# EAGLE schematic milliLearn-ice40-pcbng (EAGLE 9.5.1)

## Sheet 1 of 4
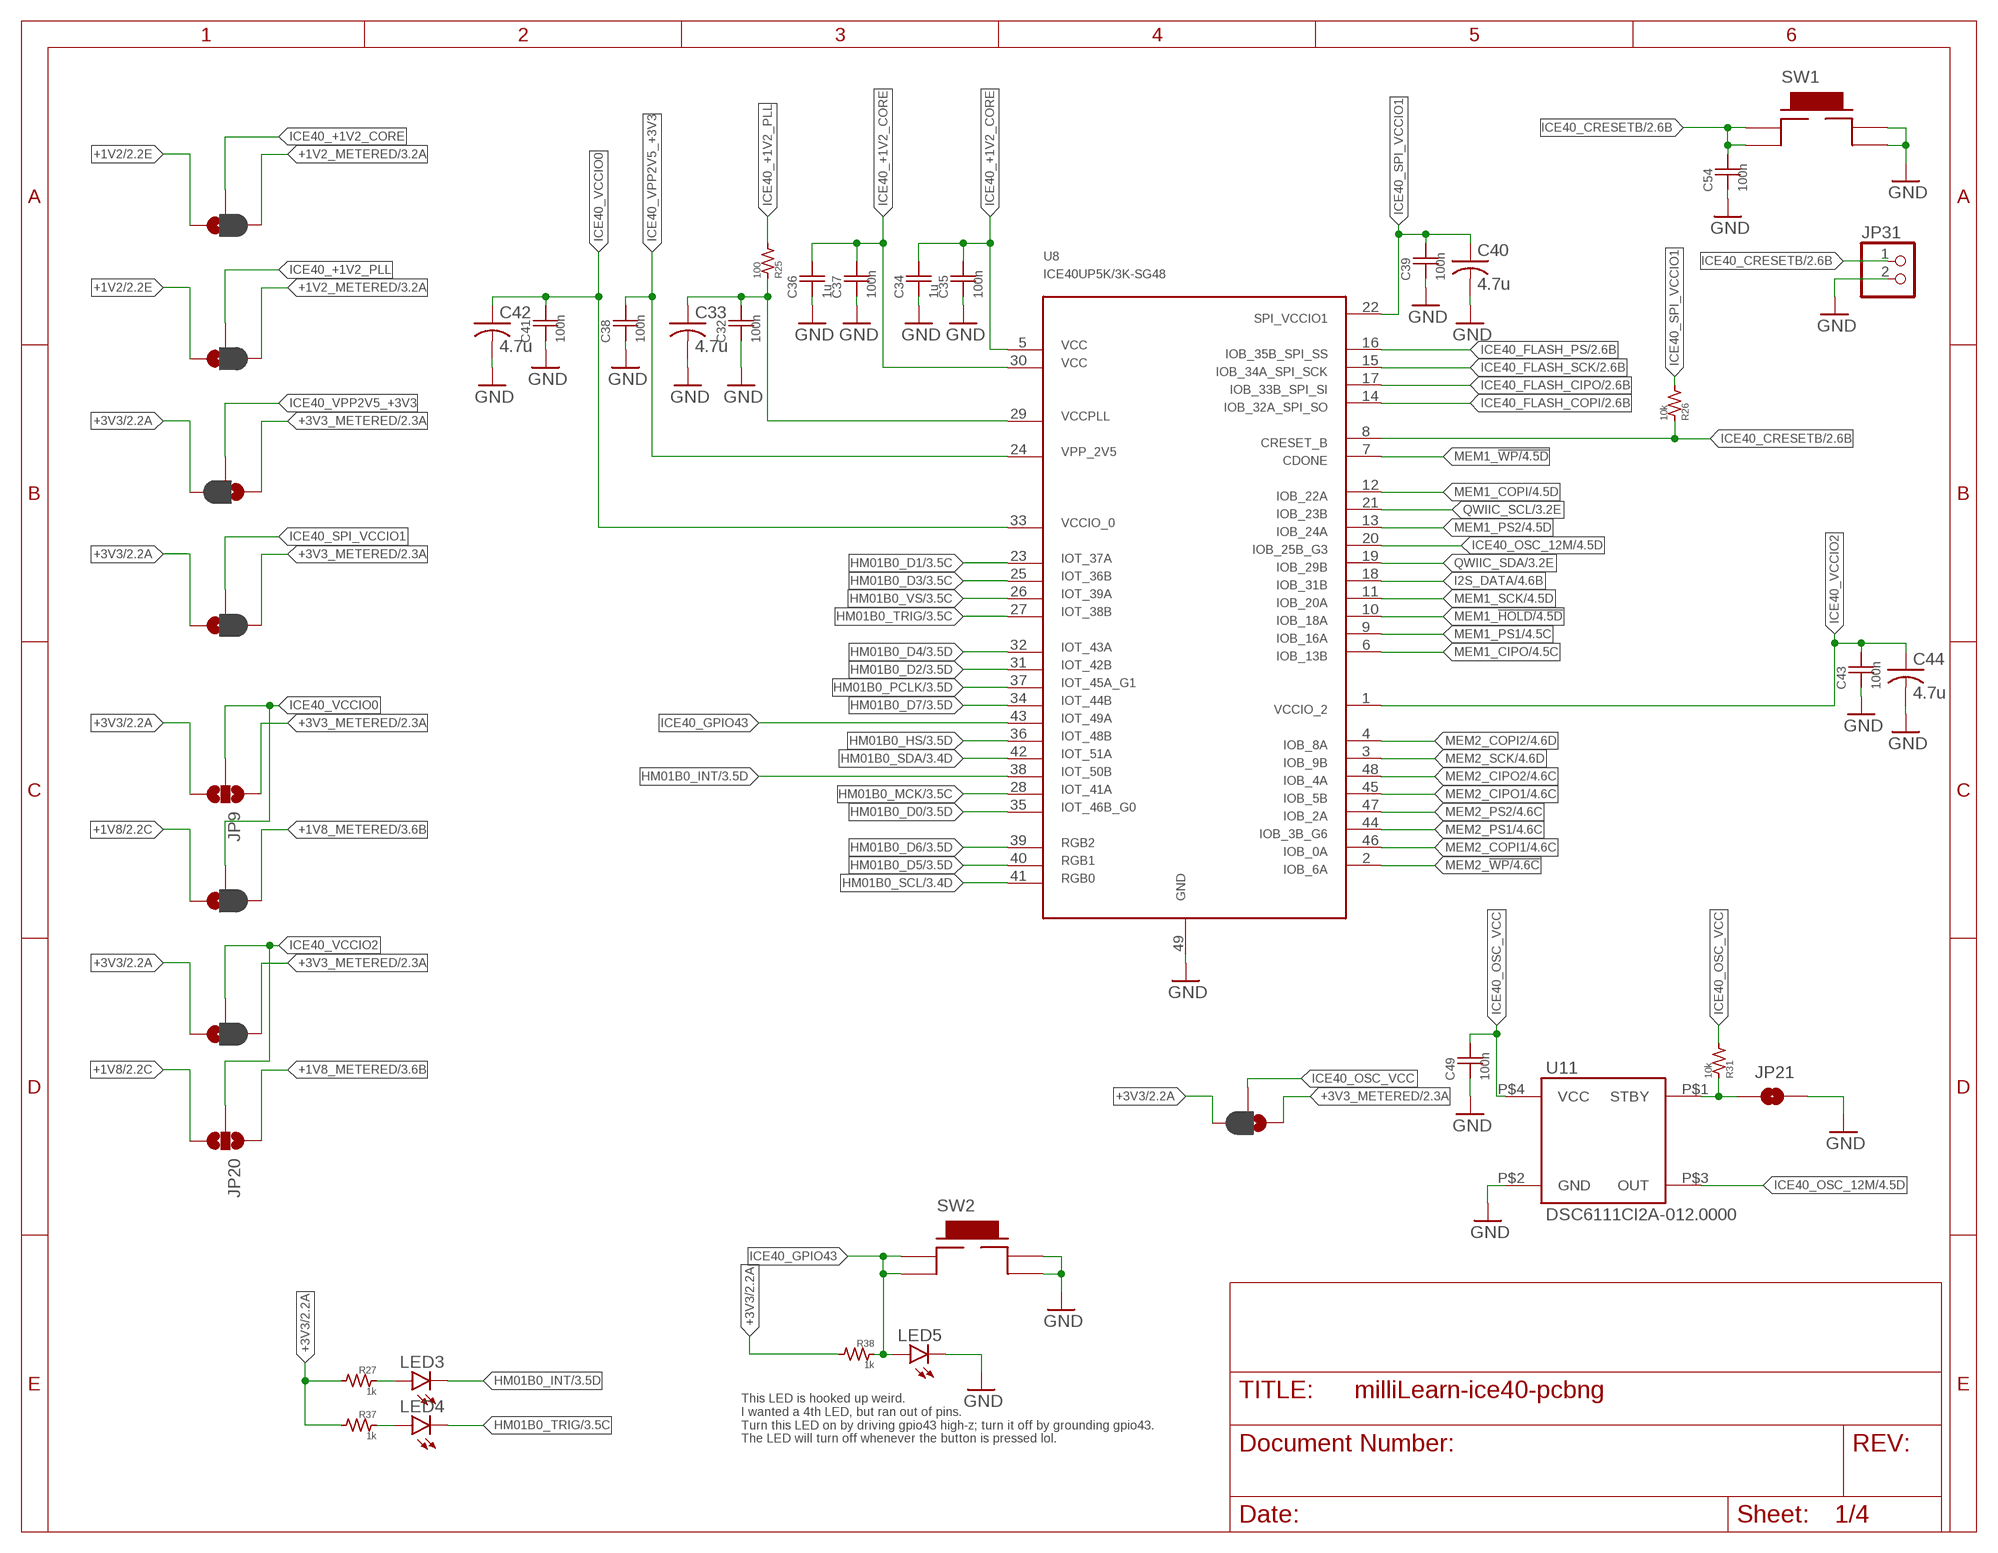
[diagram p0: schematic, sheet 1]

### Parts
C32  100n  C0402_COMPACT  [C0402_COMPACT]
C33  4.7u  C-USC0603  [C0603]
C34  1u  C0402_COMPACT  [C0402_COMPACT]
C35  100n  C0402_COMPACT  [C0402_COMPACT]
C36  1u  C0402_COMPACT  [C0402_COMPACT]
C37  100n  C0402_COMPACT  [C0402_COMPACT]
C38  100n  C0402_COMPACT  [C0402_COMPACT]
C39  100n  C0402_COMPACT  [C0402_COMPACT]
C40  4.7u  C-USC0603  [C0603]
C41  100n  C0402_COMPACT  [C0402_COMPACT]
C42  4.7u  C-USC0603  [C0603]
C43  100n  C0402_COMPACT  [C0402_COMPACT]
C44  4.7u  C-USC0603  [C0603]
C49  100n  C0402_COMPACT  [C0402_COMPACT]
C54  100n  C0402_COMPACT  [C0402_COMPACT]
JP5  JUMPER-SMT_3_1-NC_PASTE_NO-SILK  [SMT-JUMPER_3_1-NC_PASTE_NO-SILK]
JP6  JUMPER-SMT_3_1-NC_PASTE_NO-SILK  [SMT-JUMPER_3_1-NC_PASTE_NO-SILK]
JP7  JUMPER-SMT_3_1-NC_PASTE_NO-SILK  [SMT-JUMPER_3_1-NC_PASTE_NO-SILK]
JP8  JUMPER-SMT_3_1-NC_PASTE_NO-SILK  [SMT-JUMPER_3_1-NC_PASTE_NO-SILK]
JP9  JUMPER-SMT_3_NO_NO-SILK  [SMT-JUMPER_3_NO_NO-SILK]
JP13  JUMPER-SMT_3_1-NC_PASTE_NO-SILK  [SMT-JUMPER_3_1-NC_PASTE_NO-SILK]
JP14  JUMPER-SMT_3_1-NC_PASTE_NO-SILK  [SMT-JUMPER_3_1-NC_PASTE_NO-SILK]
JP19  JUMPER-SMT_3_1-NC_PASTE_NO-SILK  [SMT-JUMPER_3_1-NC_PASTE_NO-SILK]
JP20  JUMPER-SMT_3_NO_NO-SILK  [SMT-JUMPER_3_NO_NO-SILK]
JP21  JUMPER-SMT_2_NO_NO-SILK  [SMT-JUMPER_2_NO_NO-SILK]
JP31  PINHD-1X2  [1X02]
LED3  LEDCHIPLED_0603  [CHIPLED_0603]
LED4  LEDCHIPLED_0603  [CHIPLED_0603]
LED5  LEDCHIPLED_0603  [CHIPLED_0603]
R25  100  R0402_COMPACT  [R0402_COMPACT]
R26  10k  R0402_COMPACT  [R0402_COMPACT]
R27  1k  R0402_COMPACT  [R0402_COMPACT]
R31  10k  R0402_COMPACT  [R0402_COMPACT]
R37  1k  R0402_COMPACT  [R0402_COMPACT]
R38  1k  R0402_COMPACT  [R0402_COMPACT]
SW1  TE_FSMJSMA  [TE_FSMJSMA]
SW2  TE_FSMJSMA  [TE_FSMJSMA]
U8  ICE40UP5K/3K-SG48  [ICE40UP5K/3K-SG48]
U11  DSC6111CI2A-012.0000  [DSC6111CI2A-012.0000]

### Nets
+1V2: JP5.1 JP6.1 ; also sheet 2,3
+1V2_METERED: JP5.3 JP6.3 ; also sheet 3
+1V8: JP13.1 JP20.3 ; also sheet 2,3,4
+1V8_METERED: JP13.3 JP20.1 ; also sheet 3,4
+3V3: JP7.3 JP8.1 JP9.3 JP14.1 JP19.3 R27.1 R37.1 R38.1 ; also sheet 2,3,4
+3V3_METERED: JP7.1 JP8.3 JP9.1 JP14.3 JP19.1 ; also sheet 2,3,4
GND: C32.1 C33.2 C34.1 C35.1 C36.1 C37.1 C38.1 C39.1 C40.2 C41.1 C42.2 C43.1 C44.2 C49.1 C54.1 JP21.2 JP31.2 LED5.C SW1.P$3 SW1.P$4 SW2.P$3 SW2.P$4 U8.49 U11.P$2(GND) ; also sheet 2,3,4
HM01B0_D0: U8.35 ; also sheet 3
HM01B0_D1: U8.23 ; also sheet 3
HM01B0_D2: U8.31 ; also sheet 3
HM01B0_D3: U8.25 ; also sheet 3
HM01B0_D4: U8.32 ; also sheet 3
HM01B0_D5: U8.40 ; also sheet 3
HM01B0_D6: U8.39 ; also sheet 3
HM01B0_D7: U8.34 ; also sheet 3
HM01B0_HS: U8.36 ; also sheet 3
HM01B0_INT: LED3.C U8.38 ; also sheet 3
HM01B0_MCK: U8.28 ; also sheet 3
HM01B0_PCLK: U8.37 ; also sheet 3
HM01B0_SCL: U8.41 ; also sheet 3
HM01B0_SDA: U8.42 ; also sheet 3
HM01B0_TRIG: LED4.C U8.27 ; also sheet 3
HM01B0_VS: U8.26 ; also sheet 3
I2S_DATA: U8.18 ; also sheet 4
ICE40_+1V2_CORE: C34.2 C35.2 C36.2 C37.2 JP5.2 U8.5 U8.30
ICE40_+1V2_PLL: JP6.2 R25.1
ICE40_CRESETB: C54.2 JP31.1 R26.2 SW1.P$1 SW1.P$2 U8.8 ; also sheet 2
ICE40_FLASH_CIPO: U8.17 ; also sheet 2,4
ICE40_FLASH_COPI: U8.14 ; also sheet 2,4
ICE40_FLASH_PS: U8.16 ; also sheet 2,4
ICE40_FLASH_SCK: U8.15 ; also sheet 2,4
ICE40_GPIO43: LED5.A R38.2 SW2.P$1 SW2.P$2 U8.43
ICE40_OSC_12M: U8.20 U11.P$3(OUT) ; also sheet 4
ICE40_OSC_VCC: C49.2 JP19.2 R31.1 U11.P$4(VCC)
ICE40_SPI_VCCIO1: C39.2 C40.1 JP8.2 R26.1 U8.22
ICE40_VCCIO0: C41.2 C42.1 JP9.2 JP13.2 U8.33
ICE40_VCCIO2: C43.2 C44.1 JP14.2 JP20.2 U8.1
ICE40_VCCPLL: C32.2 C33.1 R25.2 U8.29
ICE40_VPP2V5_+3V3: C38.2 JP7.2 U8.24
MEM1_!HOLD: U8.10 ; also sheet 4
MEM1_!WP: U8.7 ; also sheet 4
MEM1_CIPO: U8.6 ; also sheet 4
MEM1_COPI: U8.12 ; also sheet 4
MEM1_PS1: U8.9 ; also sheet 4
MEM1_PS2: U8.13 ; also sheet 4
MEM1_SCK: U8.11 ; also sheet 4
MEM2_!WP: U8.2 ; also sheet 4
MEM2_CIPO1: U8.45 ; also sheet 4
MEM2_CIPO2: U8.48 ; also sheet 4
MEM2_COPI1: U8.46 ; also sheet 4
MEM2_COPI2: U8.4 ; also sheet 4
MEM2_PS1: U8.44 ; also sheet 4
MEM2_PS2: U8.47 ; also sheet 4
MEM2_SCK: U8.3 ; also sheet 4
N$30: JP21.1 R31.2 U11.P$1(STBY)
N$31: LED3.A R27.2
N$33: LED4.A R37.2
QWIIC_SCL: U8.21 ; also sheet 3,4
QWIIC_SDA: U8.19 ; also sheet 3,4

### Notes on the sheet
- This LED is hooked up weird.
  I wanted a 4th LED, but ran out of pins.
  Turn this LED on by driving gpio43 high-z; turn it off by grounding gpio43.
  The LED will turn off whenever the button is pressed lol.

## Sheet 2 of 4
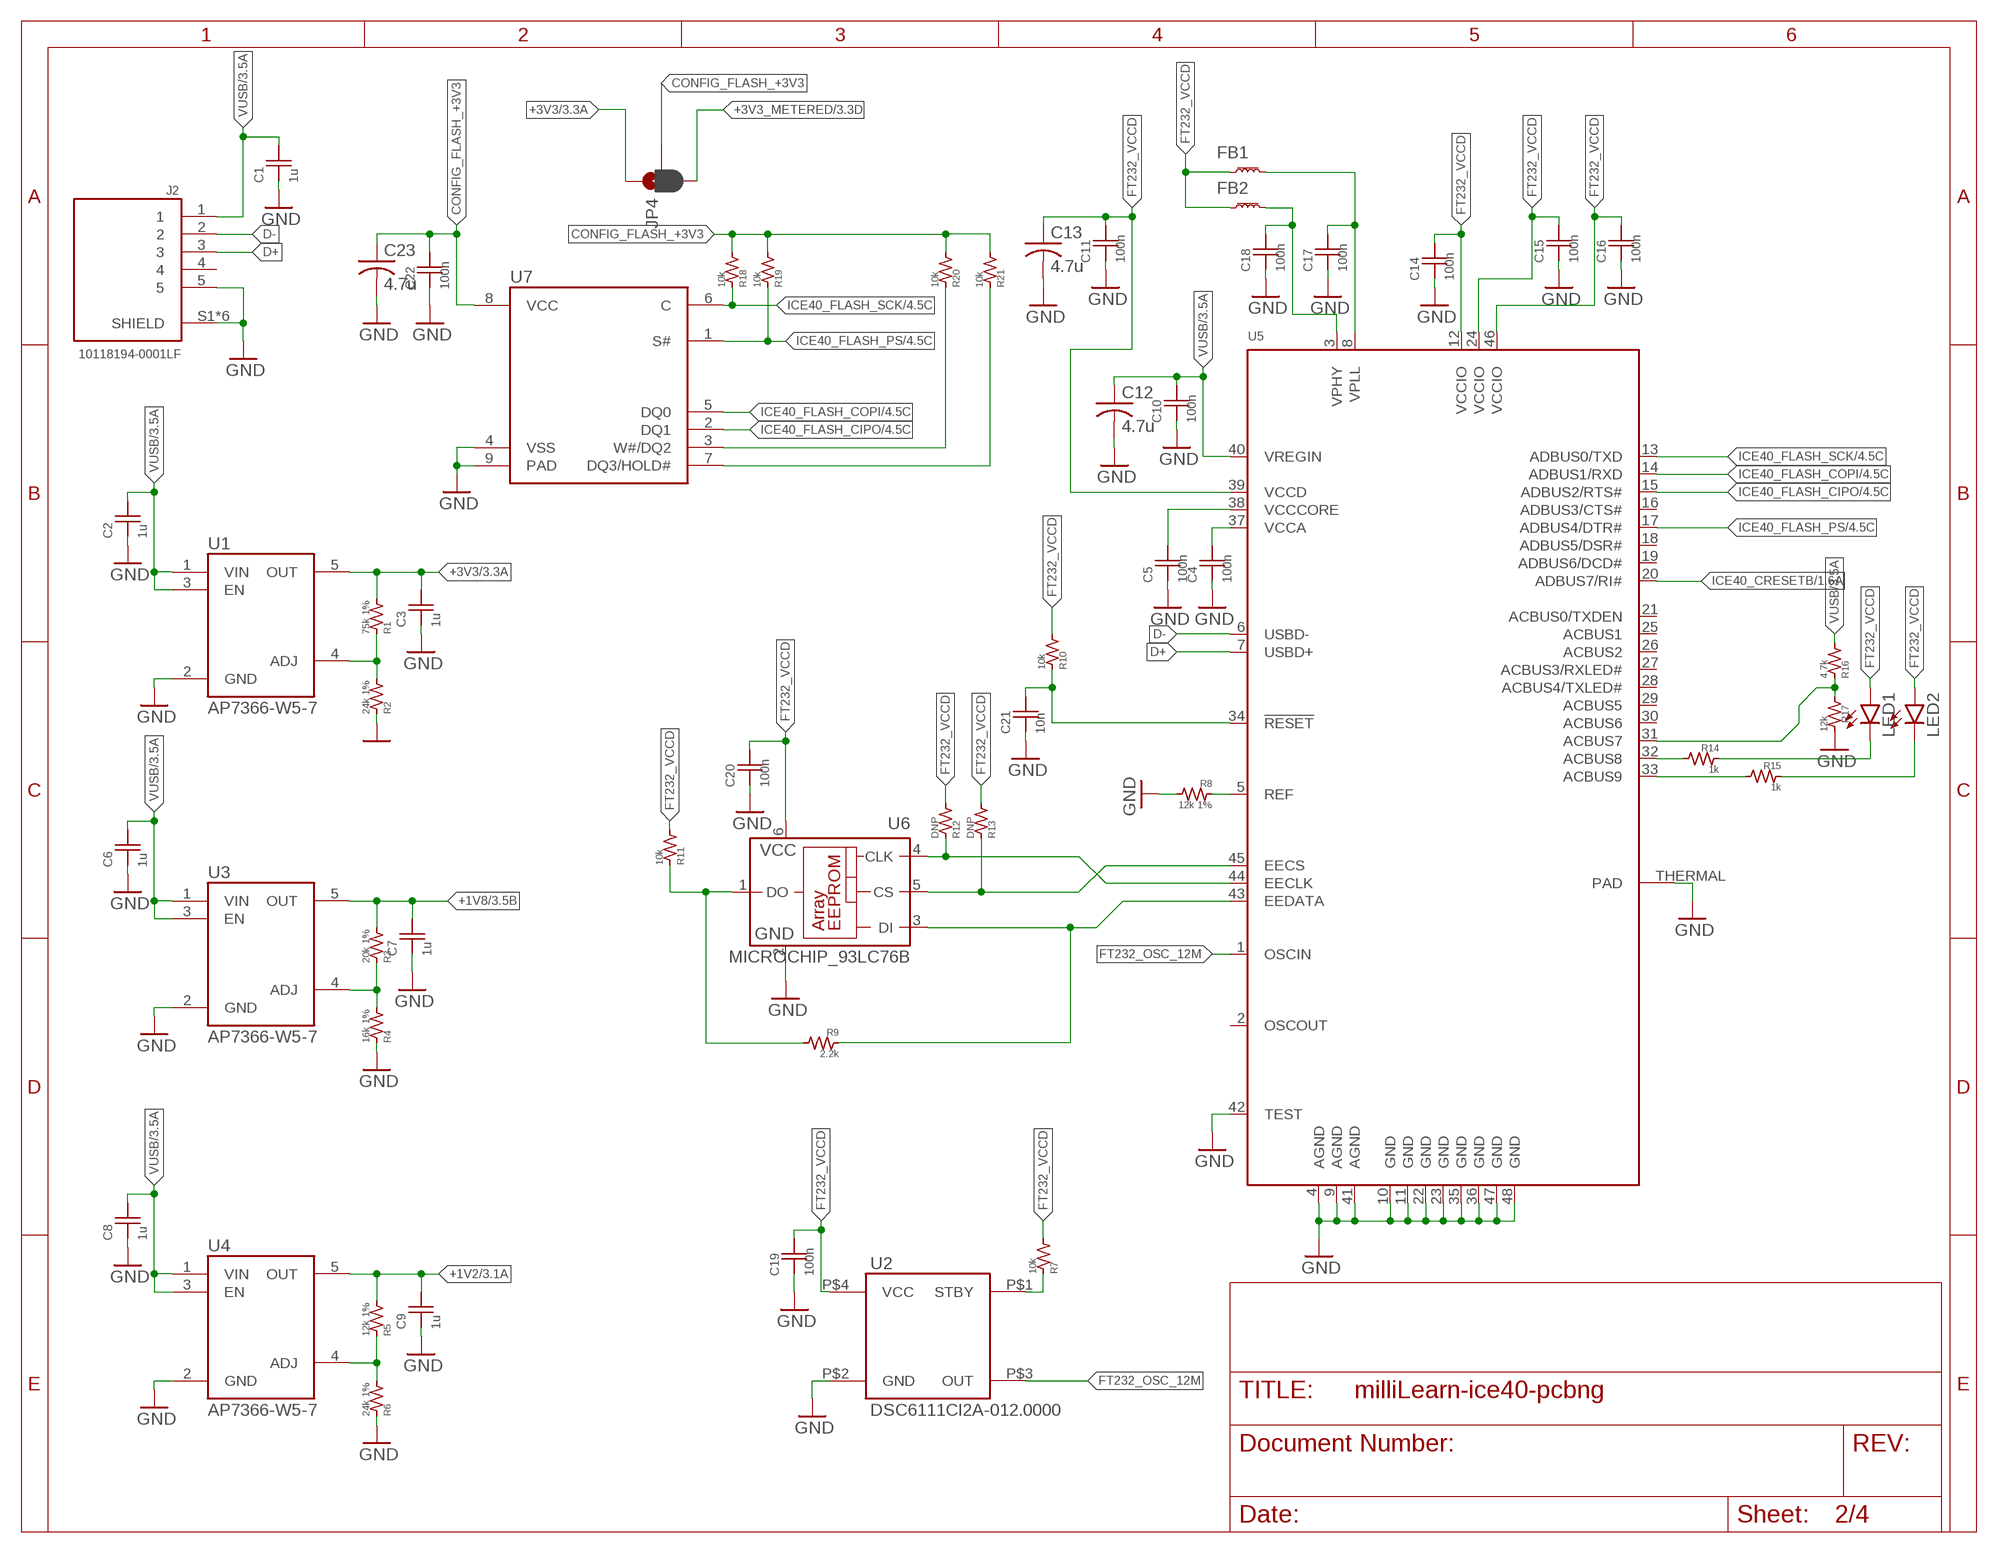
[diagram p1: schematic, sheet 2]

### Parts
C1  1u  C0402_COMPACT  [C0402_COMPACT]
C2  1u  C0402_COMPACT  [C0402_COMPACT]
C3  1u  C0402_COMPACT  [C0402_COMPACT]
C4  100n  C0402_COMPACT  [C0402_COMPACT]
C5  100n  C0402_COMPACT  [C0402_COMPACT]
C6  1u  C0402_COMPACT  [C0402_COMPACT]
C7  1u  C0402_COMPACT  [C0402_COMPACT]
C8  1u  C0402_COMPACT  [C0402_COMPACT]
C9  1u  C0402_COMPACT  [C0402_COMPACT]
C10  100n  C0402_COMPACT  [C0402_COMPACT]
C11  100n  C0402_COMPACT  [C0402_COMPACT]
C12  4.7u  C-USC0603  [C0603]
C13  4.7u  C-USC0603  [C0603]
C14  100n  C0402_COMPACT  [C0402_COMPACT]
C15  100n  C0402_COMPACT  [C0402_COMPACT]
C16  100n  C0402_COMPACT  [C0402_COMPACT]
C17  100n  C0402_COMPACT  [C0402_COMPACT]
C18  100n  C0402_COMPACT  [C0402_COMPACT]
C19  100n  C0402_COMPACT  [C0402_COMPACT]
C20  100n  C0402_COMPACT  [C0402_COMPACT]
C21  10n  C0402_COMPACT  [C0402_COMPACT]
C22  100n  C0402_COMPACT  [C0402_COMPACT]
C23  4.7u  C-USC0603  [C0603]
FB1  BLM18KG601SN1D  [BLM18KG601SN1D]
FB2  BLM18KG601SN1D  [BLM18KG601SN1D]
J2  10118194-0001LF  [AMPHENOL_10118194-0001LF]
JP4  JUMPER-SMT_3_1-NC_PASTE_NO-SILK  [SMT-JUMPER_3_1-NC_PASTE_NO-SILK]
LED1  LEDCHIPLED_0603  [CHIPLED_0603]
LED2  LEDCHIPLED_0603  [CHIPLED_0603]
R1  75k 1%  R0402_COMPACT  [R0402_COMPACT]
R2  24k 1%  R0402_COMPACT  [R0402_COMPACT]
R3  20k 1%  R0402_COMPACT  [R0402_COMPACT]
R4  16k 1%  R0402_COMPACT  [R0402_COMPACT]
R5  12k 1%  R0402_COMPACT  [R0402_COMPACT]
R6  24k 1%  R0402_COMPACT  [R0402_COMPACT]
R7  10k  R0402_COMPACT  [R0402_COMPACT]
R8  12k 1%  R0402_COMPACT  [R0402_COMPACT]
R9  2.2k  R0402_COMPACT  [R0402_COMPACT]
R10  10k  R0402_COMPACT  [R0402_COMPACT]
R11  10k  R0402_COMPACT  [R0402_COMPACT]
R12  DNP  R0402_COMPACT  [R0402_COMPACT]
R13  DNP  R0402_COMPACT  [R0402_COMPACT]
R14  1k  R0402_COMPACT  [R0402_COMPACT]
R15  1k  R0402_COMPACT  [R0402_COMPACT]
R16  4.7k  R0402_COMPACT  [R0402_COMPACT]
R17  12k  R0402_COMPACT  [R0402_COMPACT]
R18  10k  R0402_COMPACT  [R0402_COMPACT]
R19  10k  R0402_COMPACT  [R0402_COMPACT]
R20  10k  R0402_COMPACT  [R0402_COMPACT]
R21  10k  R0402_COMPACT  [R0402_COMPACT]
U1  AP7366-W5-7  [AP7366-W5-7]
U2  DSC6111CI2A-012.0000  [DSC6111CI2A-012.0000]
U3  AP7366-W5-7  [AP7366-W5-7]
U4  AP7366-W5-7  [AP7366-W5-7]
U5  MICROBUILDER_FT232HQ  [MICROBUILDER_QFN48_8MM]
U6  MICROCHIP_93LC76B  [MICROCHIP_SOT23-6]
U7  MT25QL128ABA1EW7  [MT25QL128ABA1EW7]

### Nets
+1V2: C9.2 R5.1 U4.5(OUT) ; also sheet 1,3
+1V8: C7.2 R3.1 U3.5(OUT) ; also sheet 1,3,4
+3V3: C3.2 JP4.1 R1.1 U1.5(OUT) ; also sheet 1,3,4
+3V3_METERED: JP4.3 ; also sheet 1,3,4
CONFIG_FLASH_+3V3: C22.2 C23.1 JP4.2 R18.1 R19.1 R20.1 R21.1 U7.8(VCC)
D+: J2.3 U5.7(USBD+)
D-: J2.2 U5.6(USBD-)
FT232_OSC_12M: U2.P$3(OUT) U5.1(OSCIN)
FT232_VCCD: C11.2 C13.1 C14.2 C15.2 C16.2 C19.2 C20.2 FB1.1 FB2.1 LED1.A LED2.A R7.1 R10.1 R11.1 R12.1 R13.1 U2.P$4(VCC) U5.12(VCCIO) U5.24(VCCIO) U5.39(VCCD) U5.46(VCCIO) U6.6(VCC)
GND: C1.1 C2.1 C3.1 C4.1 C5.1 C6.1 C7.1 C8.1 C9.1 C10.1 C11.1 C12.2 C13.2 C14.1 C15.1 C16.1 C17.1 C18.1 C19.1 C20.1 C21.1 C22.1 C23.2 J2.5 J2.S1(SHIELD) J2.S2(SHIELD) J2.S3(SHIELD) J2.S4(SHIELD) J2.S5(SHIELD) J2.S6(SHIELD) R2.2 R4.2 R6.2 R8.1 R17.2 U1.2(GND) U2.P$2(GND) U3.2(GND) U4.2(GND) U5.4(AGND) U5.9(AGND) U5.10(GND) U5.11(GND) U5.22(GND) U5.23(GND) U5.35(GND) U5.36(GND) U5.41(AGND) U5.42(TEST) U5.47(GND) U5.48(GND) U5.THERMAL(PAD) U6.2(GND) U7.4(VSS) U7.9(PAD) ; also sheet 1,3,4
ICE40_CRESETB: U5.20(ADBUS7/RI#) ; also sheet 1
ICE40_FLASH_CIPO: U5.15(ADBUS2/RTS#) U7.2(DQ1) ; also sheet 1,4
ICE40_FLASH_COPI: U5.14(ADBUS1/RXD) U7.5(DQ0) ; also sheet 1,4
ICE40_FLASH_PS: R19.2 U5.17(ADBUS4/DTR#) U7.1(S#) ; also sheet 1,4
ICE40_FLASH_SCK: R18.2 U5.13(ADBUS0/TXD) U7.6(C) ; also sheet 1,4
N$1: R5.2 R6.1 U4.4(ADJ)
N$2: R1.2 R2.1 U1.4(ADJ)
N$4: C18.2 FB2.2 U5.3(VPHY)
N$5: C17.2 FB1.2 U5.8(VPLL)
N$6: R3.2 R4.1 U3.4(ADJ)
N$7: R7.2 U2.P$1(STBY)
N$8: R9.1 R11.2 U6.1(DO)
N$9: R8.2 U5.5(REF)
N$10: R9.2 U5.43(EEDATA) U6.3(DI)
N$11: R13.2 U5.45(EECS) U6.5(CS)
N$12: R12.2 U5.44(EECLK) U6.4(CLK)
N$13: R14.1 U5.32(ACBUS8)
N$14: C21.2 R10.2 U5.34(!RESET)
N$15: LED1.C R14.2
N$16: R16.2 R17.1 U5.31(ACBUS7)
N$17: R15.1 U5.33(ACBUS9)
N$18: LED2.C R15.2
N$19: R20.2 U7.3(W#/DQ2)
N$20: R21.2 U7.7(DQ3/HOLD#)
VCCA: C4.2 U5.37(VCCA)
VCCCORE: C5.2 U5.38(VCCCORE)
VUSB: C1.2 C2.2 C6.2 C8.2 C10.2 C12.1 J2.1 R16.1 U1.1(VIN) U1.3(EN) U3.1(VIN) U3.3(EN) U4.1(VIN) U4.3(EN) U5.40(VREGIN) ; also sheet 3
Unconnected: J2.4 U5.2(OSCOUT) U5.16(ADBUS3/CTS#) U5.18(ADBUS5/DSR#) U5.19(ADBUS6/DCD#) U5.21(ACBUS0/TXDEN) U5.25(ACBUS1) U5.26(ACBUS2) U5.27(ACBUS3/RXLED#) U5.28(ACBUS4/TXLED#) U5.29(ACBUS5) U5.30(ACBUS6)

## Sheet 3 of 4
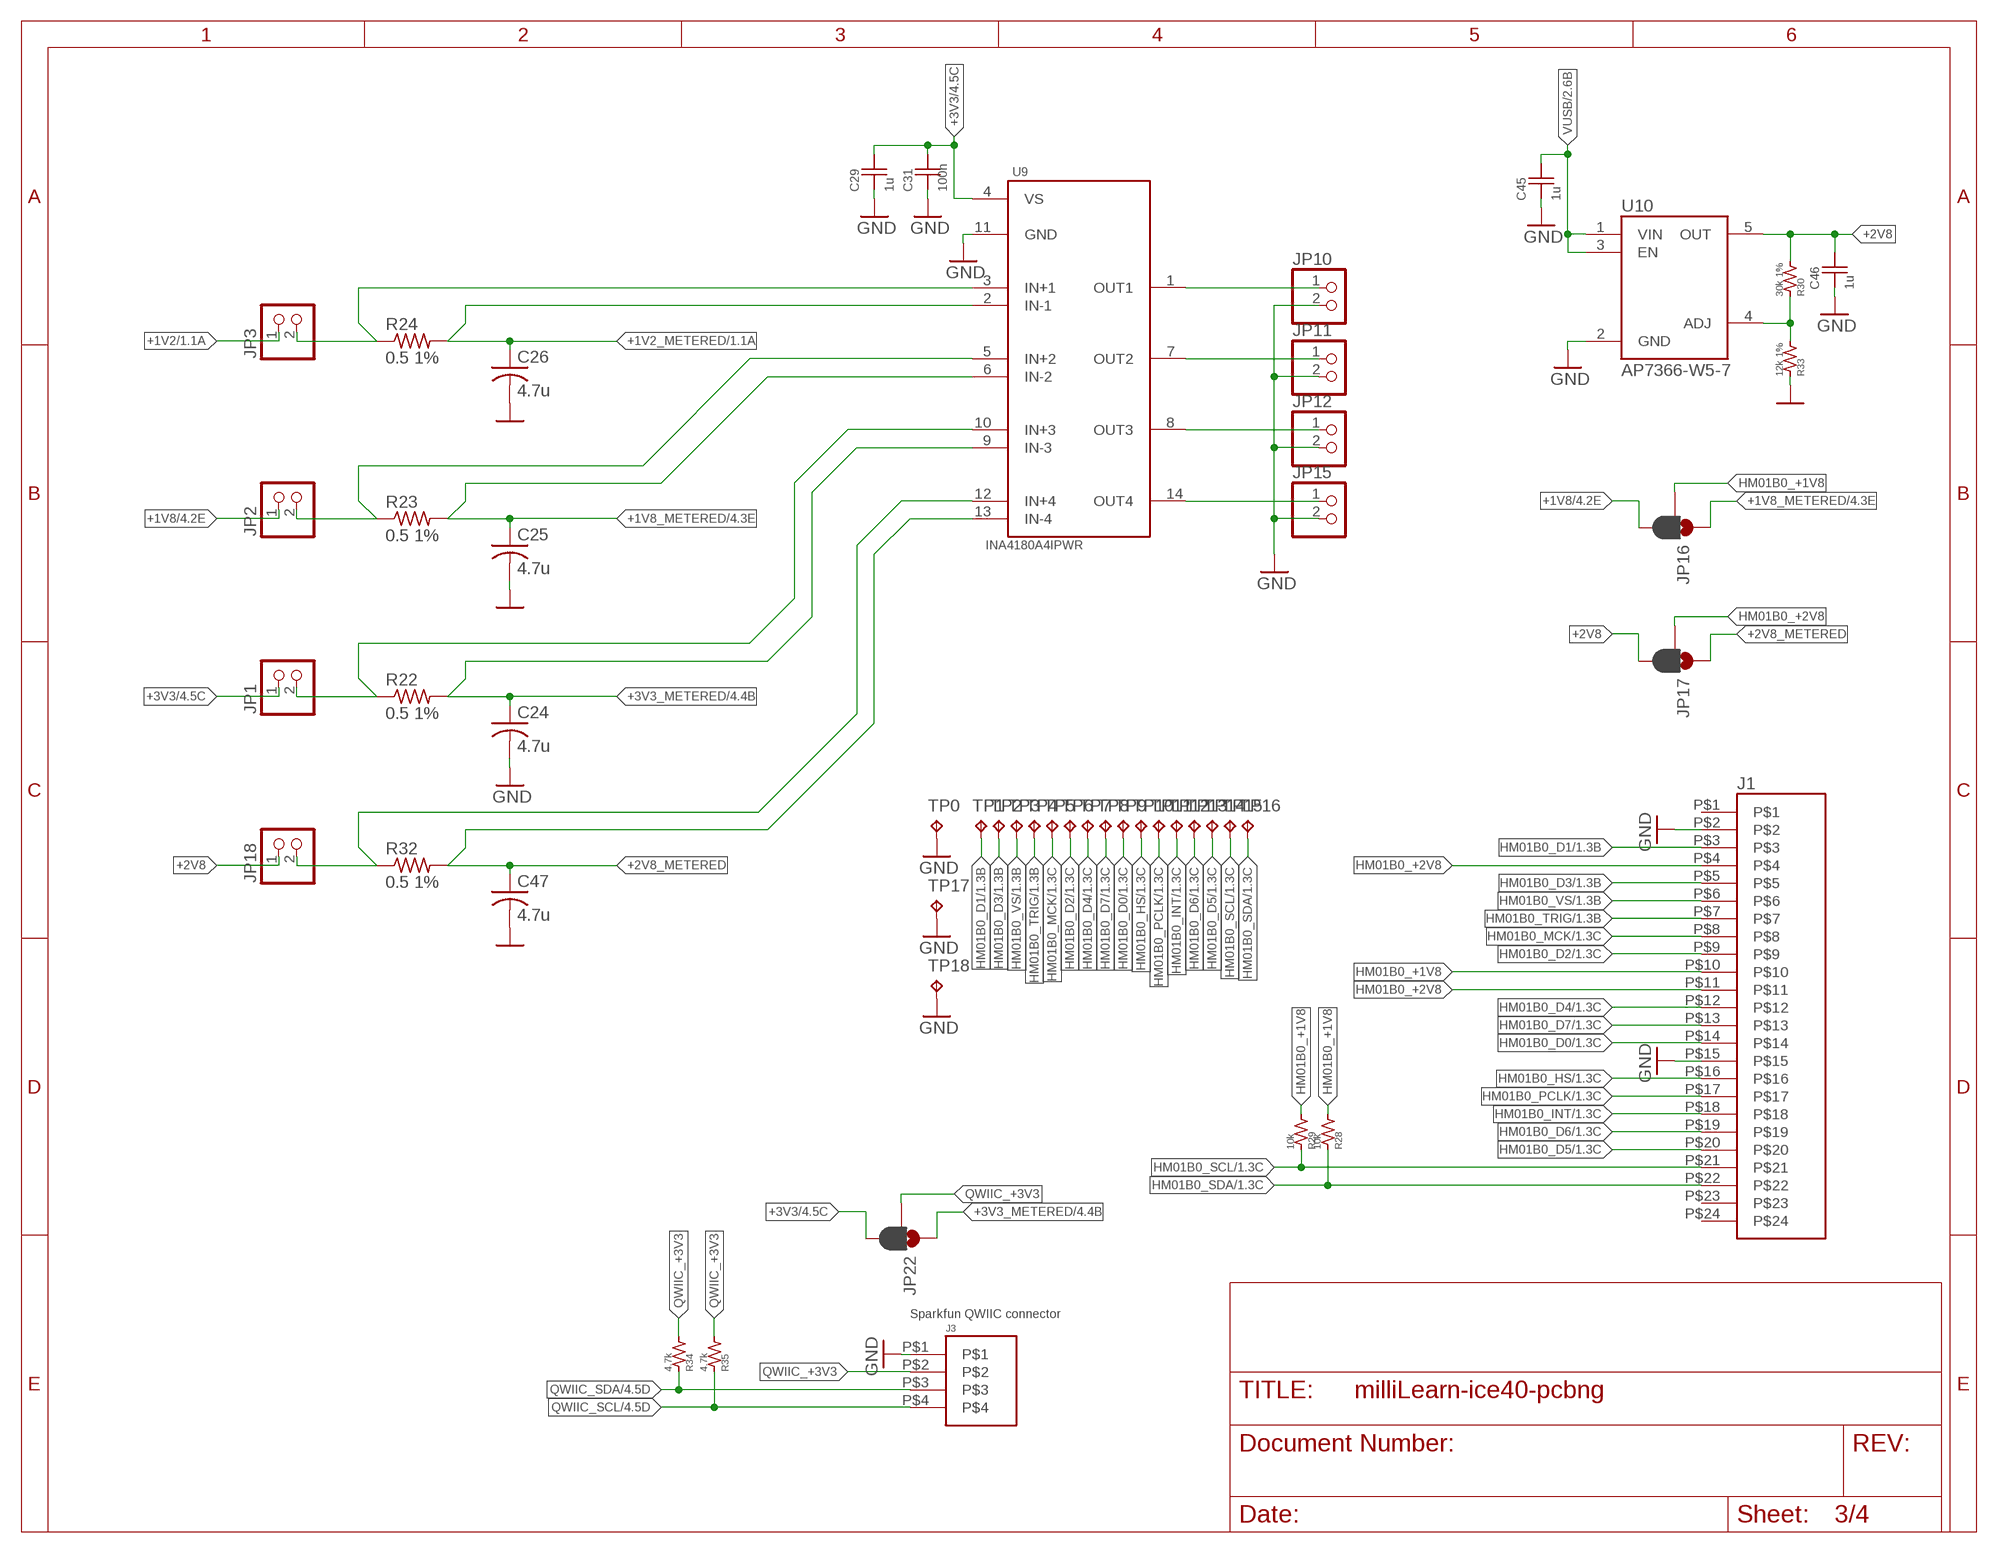
[diagram p2: schematic, sheet 3]

### Parts
C24  4.7u  C-USC0603  [C0603]
C25  4.7u  C-USC0603  [C0603]
C26  4.7u  C-USC0603  [C0603]
C29  1u  C0402_COMPACT  [C0402_COMPACT]
C31  100n  C0402_COMPACT  [C0402_COMPACT]
C45  1u  C0402_COMPACT  [C0402_COMPACT]
C46  1u  C0402_COMPACT  [C0402_COMPACT]
C47  4.7u  C-USC0603  [C0603]
J1  SFV24R-2STE1HLF  [SFV24R-2STE1HLF]
J3  SM04B-SRSS-TB(LF)(SN)  [SM04B-SRSS-TB(LF)(SN)]
JP1  PINHD-1X2  [1X02]
JP2  PINHD-1X2  [1X02]
JP3  PINHD-1X2  [1X02]
JP10  PINHD-1X2  [1X02]
JP11  PINHD-1X2  [1X02]
JP12  PINHD-1X2  [1X02]
JP15  PINHD-1X2  [1X02]
JP16  JUMPER-SMT_3_1-NC_PASTE_NO-SILK  [SMT-JUMPER_3_1-NC_PASTE_NO-SILK]
JP17  JUMPER-SMT_3_1-NC_PASTE_NO-SILK  [SMT-JUMPER_3_1-NC_PASTE_NO-SILK]
JP18  PINHD-1X2  [1X02]
JP22  JUMPER-SMT_3_1-NC_PASTE_NO-SILK  [SMT-JUMPER_3_1-NC_PASTE_NO-SILK]
R22  0.5 1%  R-US_R0603  [R0603]
R23  0.5 1%  R-US_R0603  [R0603]
R24  0.5 1%  R-US_R0603  [R0603]
R28  10k  R0402_COMPACT  [R0402_COMPACT]
R29  10k  R0402_COMPACT  [R0402_COMPACT]
R30  30k 1%  R0402_COMPACT  [R0402_COMPACT]
R32  0.5 1%  R-US_R0603  [R0603]
R33  12k 1%  R0402_COMPACT  [R0402_COMPACT]
R34  4.7k  R0402_COMPACT  [R0402_COMPACT]
R35  4.7k  R0402_COMPACT  [R0402_COMPACT]
TP0  TPTP10SQ  [TP10SQ]
TP1  TPTP10SQ  [TP10SQ]
TP2  TPTP10SQ  [TP10SQ]
TP3  TPTP10SQ  [TP10SQ]
TP4  TPTP10SQ  [TP10SQ]
TP5  TPTP10SQ  [TP10SQ]
TP6  TPTP10SQ  [TP10SQ]
TP7  TPTP10SQ  [TP10SQ]
TP8  TPTP10SQ  [TP10SQ]
TP9  TPTP10SQ  [TP10SQ]
TP10  TPTP10SQ  [TP10SQ]
TP11  TPTP10SQ  [TP10SQ]
TP12  TPTP10SQ  [TP10SQ]
TP13  TPTP10SQ  [TP10SQ]
TP14  TPTP10SQ  [TP10SQ]
TP15  TPTP10SQ  [TP10SQ]
TP16  TPTP10SQ  [TP10SQ]
TP17  TPTP10SQ  [TP10SQ]
TP18  TPTP10SQ  [TP10SQ]
U9  INA4180A4IPWR  [INA4180A4IPWR]
U10  AP7366-W5-7  [AP7366-W5-7]

### Nets
+1V2: JP3.1 ; also sheet 1,2
+1V2_METERED: C26.1 R24.2 U9.2(IN-1) ; also sheet 1
+1V8: JP2.1 JP16.3 ; also sheet 1,2,4
+1V8_METERED: C25.1 JP16.1 R23.2 U9.6(IN-2) ; also sheet 1,4
+2V8: C46.2 JP17.3 JP18.1 R30.1 U10.5(OUT)
+2V8_METERED: C47.1 JP17.1 R32.2 U9.13(IN-4)
+3V3: C29.2 C31.2 JP1.1 JP22.3 U9.4(VS) ; also sheet 1,2,4
+3V3_METERED: C24.1 JP22.1 R22.2 U9.9(IN-3) ; also sheet 1,2,4
GND: C24.2 C25.2 C26.2 C29.1 C31.1 C45.1 C46.1 C47.2 J1.P$2 J1.P$15 J3.P$1 JP10.2 JP11.2 JP12.2 JP15.2 R33.2 TP0.TP TP17.TP TP18.TP U9.11(GND) U10.2(GND) ; also sheet 1,2,4
HM01B0_+1V8: J1.P$10 JP16.2 R28.1 R29.1
HM01B0_+2V8: J1.P$4 J1.P$11 JP17.2
HM01B0_D0: J1.P$14 TP9.TP ; also sheet 1
HM01B0_D1: J1.P$3 TP1.TP ; also sheet 1
HM01B0_D2: J1.P$9 TP6.TP ; also sheet 1
HM01B0_D3: J1.P$5 TP2.TP ; also sheet 1
HM01B0_D4: J1.P$12 TP7.TP ; also sheet 1
HM01B0_D5: J1.P$20 TP14.TP ; also sheet 1
HM01B0_D6: J1.P$19 TP13.TP ; also sheet 1
HM01B0_D7: J1.P$13 TP8.TP ; also sheet 1
HM01B0_HS: J1.P$16 TP10.TP ; also sheet 1
HM01B0_INT: J1.P$18 TP12.TP ; also sheet 1
HM01B0_MCK: J1.P$8 TP5.TP ; also sheet 1
HM01B0_PCLK: J1.P$17 TP11.TP ; also sheet 1
HM01B0_SCL: J1.P$21 R29.2 TP15.TP ; also sheet 1
HM01B0_SDA: J1.P$22 R28.2 TP16.TP ; also sheet 1
HM01B0_TRIG: J1.P$7 TP4.TP ; also sheet 1
HM01B0_VS: J1.P$6 TP3.TP ; also sheet 1
MEAS_1V2: JP10.1 U9.1(OUT1)
MEAS_1V8: JP11.1 U9.7(OUT2)
MEAS_2V8: JP15.1 U9.14(OUT4)
MEAS_3V3: JP12.1 U9.8(OUT3)
N$3: JP3.2 R24.1 U9.3(IN+1)
N$21: JP2.2 R23.1 U9.5(IN+2)
N$22: JP1.2 R22.1 U9.10(IN+3)
N$28: R30.2 R33.1 U10.4(ADJ)
N$29: JP18.2 R32.1 U9.12(IN+4)
QWIIC_+3V3: J3.P$2 JP22.2 R34.1 R35.1
QWIIC_SCL: J3.P$4 R35.2 ; also sheet 1,4
QWIIC_SDA: J3.P$3 R34.2 ; also sheet 1,4
VUSB: C45.2 U10.1(VIN) U10.3(EN) ; also sheet 2
Unconnected: J1.P$1 J1.P$23 J1.P$24

### Notes on the sheet
- Sparkfun QWIIC connector

## Sheet 4 of 4
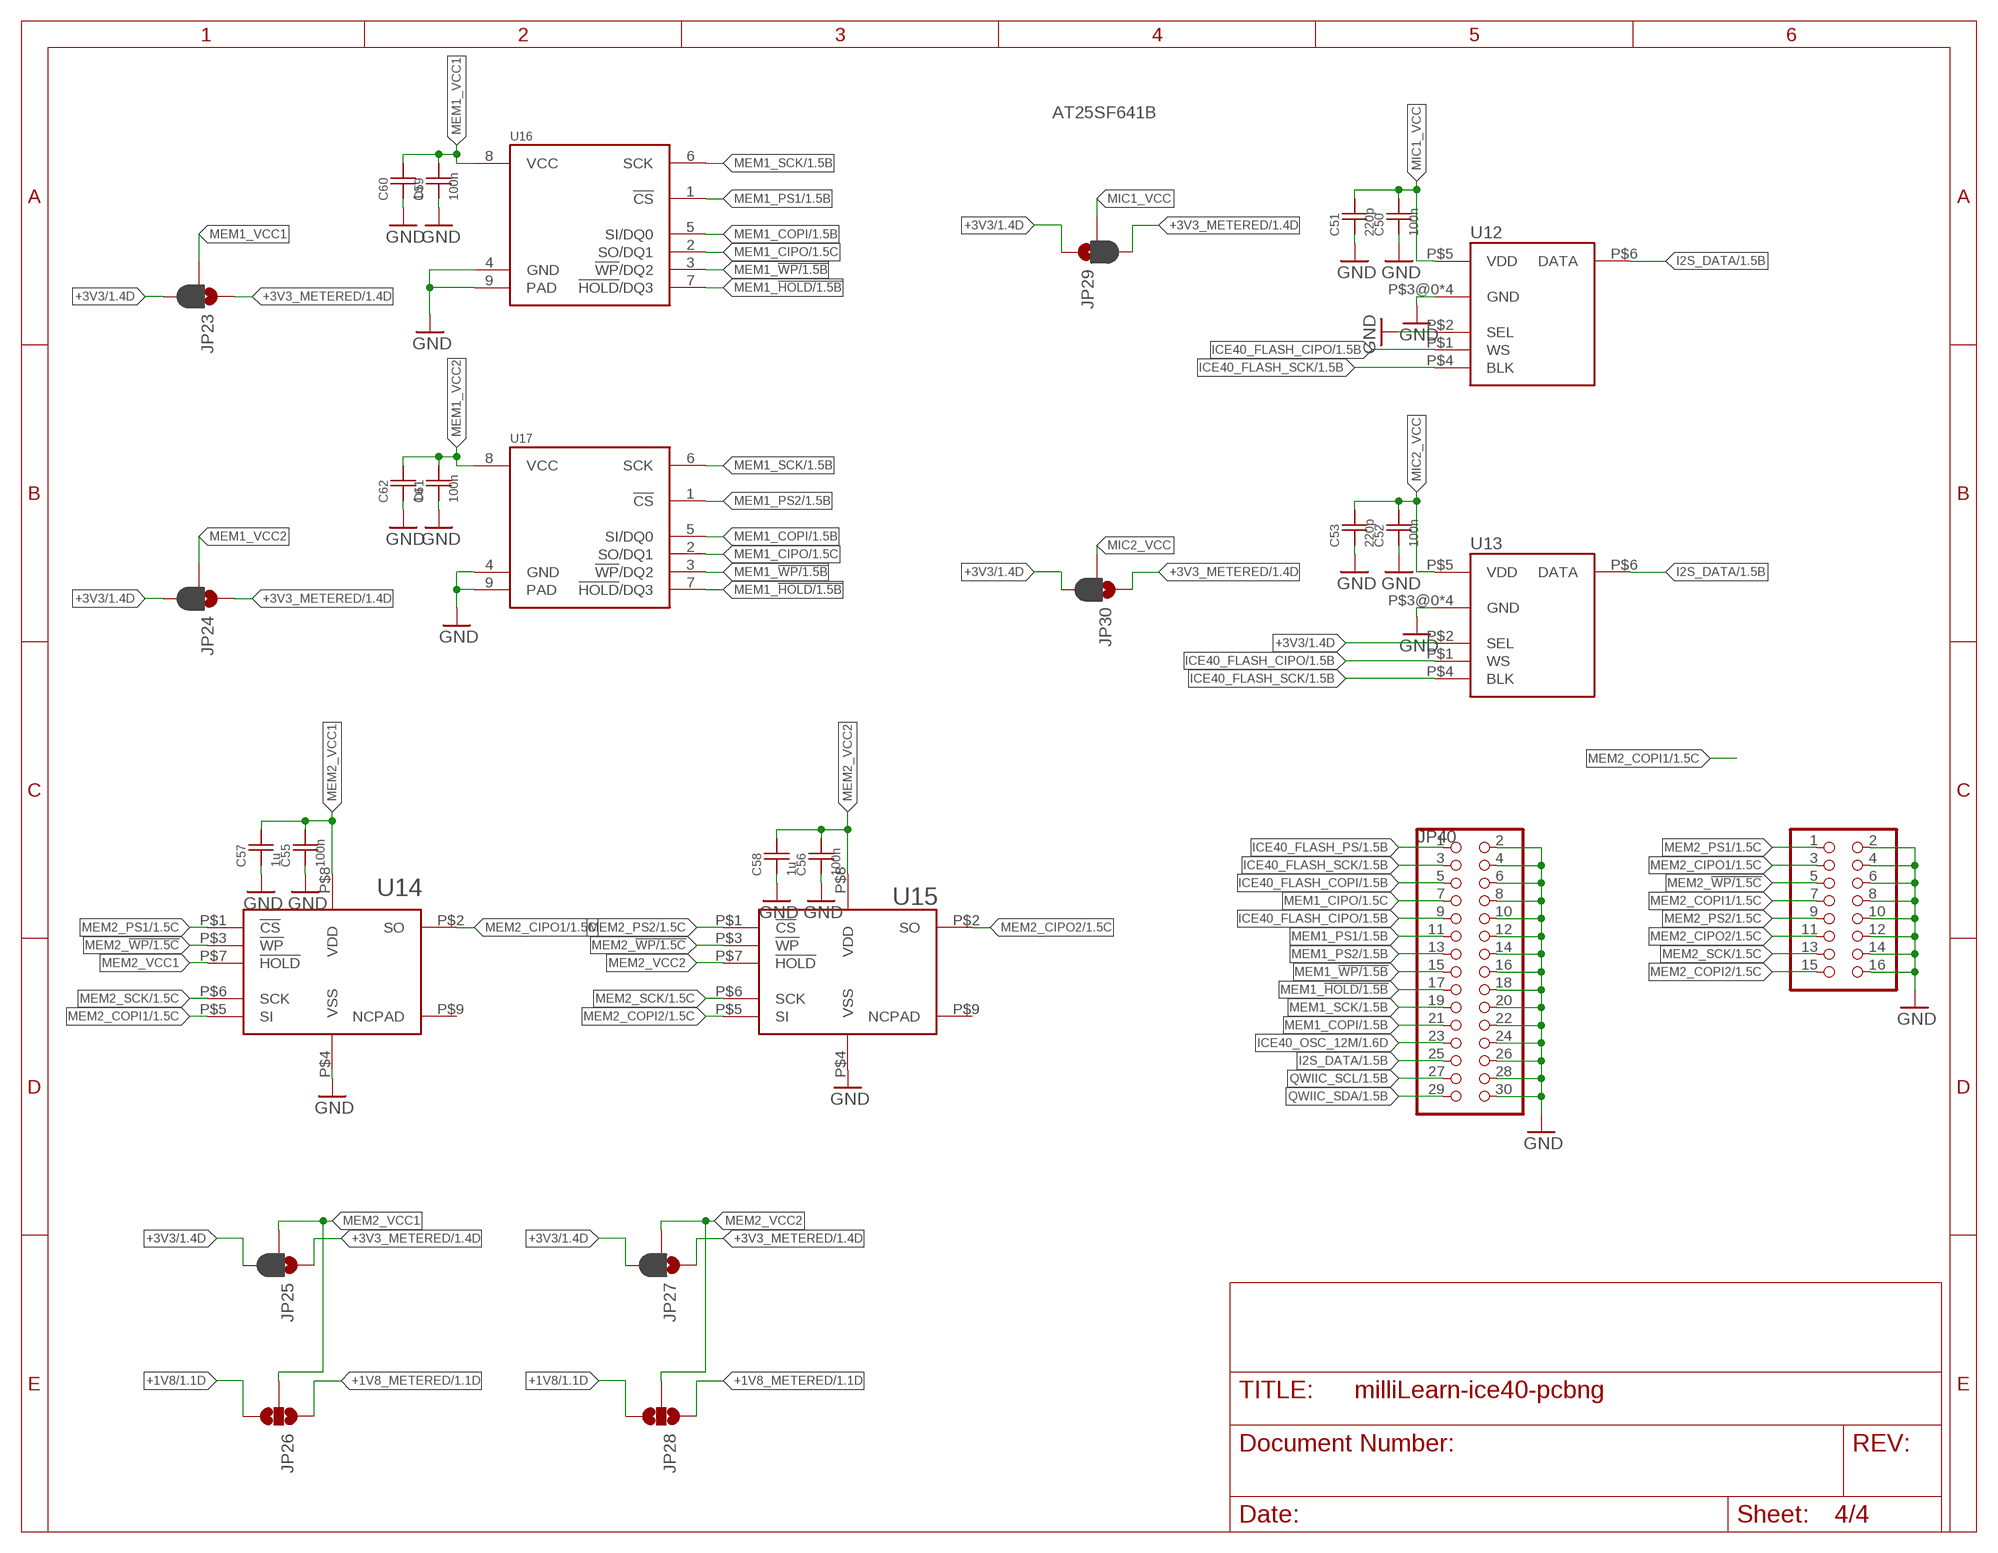
[diagram p3: schematic, sheet 4]

### Parts
C50  100n  C0402_COMPACT  [C0402_COMPACT]
C51  220p  C0402_COMPACT  [C0402_COMPACT]
C52  100n  C0402_COMPACT  [C0402_COMPACT]
C53  220p  C0402_COMPACT  [C0402_COMPACT]
C55  100n  C0402_COMPACT  [C0402_COMPACT]
C56  100n  C0402_COMPACT  [C0402_COMPACT]
C57  1u  C0402_COMPACT  [C0402_COMPACT]
C58  1u  C0402_COMPACT  [C0402_COMPACT]
C59  100n  C0402_COMPACT  [C0402_COMPACT]
C60  1u  C0402_COMPACT  [C0402_COMPACT]
C61  100n  C0402_COMPACT  [C0402_COMPACT]
C62  1u  C0402_COMPACT  [C0402_COMPACT]
JP23  JUMPER-SMT_3_1-NC_PASTE_NO-SILK  [SMT-JUMPER_3_1-NC_PASTE_NO-SILK]
JP24  JUMPER-SMT_3_1-NC_PASTE_NO-SILK  [SMT-JUMPER_3_1-NC_PASTE_NO-SILK]
JP25  JUMPER-SMT_3_1-NC_PASTE_NO-SILK  [SMT-JUMPER_3_1-NC_PASTE_NO-SILK]
JP26  JUMPER-SMT_3_NO_NO-SILK  [SMT-JUMPER_3_NO_NO-SILK]
JP27  JUMPER-SMT_3_1-NC_PASTE_NO-SILK  [SMT-JUMPER_3_1-NC_PASTE_NO-SILK]
JP28  JUMPER-SMT_3_NO_NO-SILK  [SMT-JUMPER_3_NO_NO-SILK]
JP29  JUMPER-SMT_3_1-NC_PASTE_NO-SILK  [SMT-JUMPER_3_1-NC_PASTE_NO-SILK]
JP30  JUMPER-SMT_3_1-NC_PASTE_NO-SILK  [SMT-JUMPER_3_1-NC_PASTE_NO-SILK]
JP40  PINHD-2X15  [2X15]
JP41  PINHD-2X8  [2X08]
U12  SPH0645LM4H-B  [SPH0645LM4H-B]
U13  SPH0645LM4H-B  [SPH0645LM4H-B]
U14  CY15B104Q-LHXI  [CY15B104Q-LHXI]
U15  CY15B104Q-LHXI  [CY15B104Q-LHXI]
U16  AT25QF641B-SHB-T  [AT25QF641B-SHB-T]
U17  AT25QF641B-SHB-T  [AT25QF641B-SHB-T]

### Nets
+1V8: JP26.3 JP28.3 ; also sheet 1,2,3
+1V8_METERED: JP26.1 JP28.1 ; also sheet 1,3
+3V3: JP23.3 JP24.3 JP25.3 JP27.3 JP29.1 JP30.3 U13.P$2(SEL) ; also sheet 1,2,3
+3V3_METERED: JP23.1 JP24.1 JP25.1 JP27.1 JP29.3 JP30.1 ; also sheet 1,2,3
GND: C50.1 C51.1 C52.1 C53.1 C55.1 C56.1 C57.1 C58.1 C59.1 C60.1 C61.1 C62.1 JP40.2 JP40.4 JP40.6 JP40.8 JP40.10 JP40.12 JP40.14 JP40.16 JP40.18 JP40.20 JP40.22 JP40.24 JP40.26 JP40.28 JP40.30 JP41.2 JP41.4 JP41.6 JP41.8 JP41.10 JP41.12 JP41.14 JP41.16 U12.P$2(SEL) U12.P$3@0(GND) U12.P$3@1(GND) U12.P$3@2(GND) U12.P$3@3(GND) U13.P$3@0(GND) U13.P$3@1(GND) U13.P$3@2(GND) U13.P$3@3(GND) U14.P$4(VSS) U15.P$4(VSS) U16.4(GND) U16.9(PAD) U17.4(GND) U17.9(PAD) ; also sheet 1,2,3
I2S_DATA: JP40.25 U12.P$6(DATA) U13.P$6(DATA) ; also sheet 1
ICE40_FLASH_CIPO: JP40.9 U12.P$1(WS) U13.P$1(WS) ; also sheet 1,2
ICE40_FLASH_COPI: JP40.5 ; also sheet 1,2
ICE40_FLASH_PS: JP40.1 ; also sheet 1,2
ICE40_FLASH_SCK: JP40.3 U12.P$4(BLK) U13.P$4(BLK) ; also sheet 1,2
ICE40_OSC_12M: JP40.23 ; also sheet 1
MEM1_!HOLD: JP40.17 U16.7(!HOLD!/DQ3) U17.7(!HOLD!/DQ3) ; also sheet 1
MEM1_!WP: JP40.15 U16.3(!WP!/DQ2) U17.3(!WP!/DQ2) ; also sheet 1
MEM1_CIPO: JP40.7 U16.2(SO/DQ1) U17.2(SO/DQ1) ; also sheet 1
MEM1_COPI: JP40.21 U16.5(SI/DQ0) U17.5(SI/DQ0) ; also sheet 1
MEM1_PS1: JP40.11 U16.1(!CS) ; also sheet 1
MEM1_PS2: JP40.13 U17.1(!CS) ; also sheet 1
MEM1_SCK: JP40.19 U16.6(SCK) U17.6(SCK) ; also sheet 1
MEM1_VCC1: C59.2 C60.2 JP23.2 U16.8(VCC)
MEM1_VCC2: C61.2 C62.2 JP24.2 U17.8(VCC)
MEM2_!WP: JP41.5 U14.P$3(!WP) U15.P$3(!WP) ; also sheet 1
MEM2_CIPO1: JP41.3 U14.P$2(SO) ; also sheet 1
MEM2_CIPO2: JP41.11 U15.P$2(SO) ; also sheet 1
MEM2_COPI1: JP41.7 U14.P$5(SI) ; also sheet 1
MEM2_COPI2: JP41.15 U15.P$5(SI) ; also sheet 1
MEM2_PS1: JP41.1 U14.P$1(!CS) ; also sheet 1
MEM2_PS2: JP41.9 U15.P$1(!CS) ; also sheet 1
MEM2_SCK: JP41.13 U14.P$6(SCK) U15.P$6(SCK) ; also sheet 1
MEM2_VCC1: C55.2 C57.2 JP25.2 JP26.2 U14.P$7(!HOLD) U14.P$8(VDD)
MEM2_VCC2: C56.2 C58.2 JP27.2 JP28.2 U15.P$7(!HOLD) U15.P$8(VDD)
MIC1_VCC: C50.2 C51.2 JP29.2 U12.P$5(VDD)
MIC2_VCC: C52.2 C53.2 JP30.2 U13.P$5(VDD)
QWIIC_SCL: JP40.27 ; also sheet 1,3
QWIIC_SDA: JP40.29 ; also sheet 1,3
Unconnected: U14.P$9(NCPAD) U15.P$9(NCPAD)

### Notes on the sheet
- AT25SF641B

## Library data of the parts
C1-C3 C6-C9 C29 C34 C36 C45 C46 C57 C58 C60 C62 = milliLearn-ice40:C0402_COMPACT; MFR: SAMSUNG; MFR_PN: CL05A105KO5NNNC
C4 C5 C10 C11 C14-C20 C22 C31 C32 C35 C37-C39 C41 C43 C49 C50 C52 C54-C56 C59 C61 = milliLearn-ice40:C0402_COMPACT; MFR: SAMSUNG; MFR_PN: CL05B104KO5NNNC
C12 C13 C23-C26 C33 C40 C42 C44 C47 = rcl:C-US: CAPACITOR, American symbol; MFR: SAMSUNG; MFR_PN: CL10A475KA8NQNC; SPICEPREFIX: C
C21 = milliLearn-ice40:C0402_COMPACT; MFR: SAMSUNG; MFR_PN: CL05B103KO5NNNC
C51 C53 = milliLearn-ice40:C0402_COMPACT; MFR: SAMSUNG; MFR_PN: CL05B221KB5NNNC
FB1 FB2 = milliLearn-ice40:BLM18KG601SN1D; MFR: MURATA; MFR_PN: BLM18KG601SN1D
J1 = milliLearn-ice40:SFV24R-2STE1HLF; MFR: AMPHENOL; MFR_PN: SFV24R-2STE1HLF
J2 = milliLearn-ice40:10118194-0001LF: Micro Usb, 2.0 Type b, Rcpt, Smt; AVAILABILITY: Unavailable; DESCRIPTION: Micro Usb, 2.0 Type b, Rcpt, Smt; MF: Amphenol ICC; MFR: 10118194-0001LF; MFR_PN: 10118194-0001LF; MP: 10118194-0001LF; PACKAGE: None; PRICE: None
J3 = milliLearn-ice40:SM04B-SRSS-TB(LF)(SN); MFR: JST; MFR_PN: SM04B-SRSS-TB(LF)(SN)
JP1-JP3 JP10-JP12 JP15 JP18 = pinhead:PINHD-1X2: PIN HEADER; MFR: WURTH ELECTRONIK; MFR_PN: 61300211121
JP4-JP8 JP13 JP14 JP16 JP17 JP19 JP22-JP25 JP27 JP29 JP30 = milliLearn-ice40:JUMPER-SMT_3_1-NC_PASTE: Normally closed solder jumper (1 of 2 connections) This jumper has an aperture in the stencil to allow solder paste to bridge one of the two connections. One connection is normally closed (NC), while the other is normally open (NO). Wick off the solder to open the connection. Reapply solder to reclose the connection. Apply solder to the other side instead to change the current path.
JP9 JP20 JP26 JP28 = milliLearn-ice40:JUMPER-SMT_3_NO: Normally open jumper This jumper has three pads in close proximity to each other. Apply solder to close the connection(s).
JP21 = milliLearn-ice40:JUMPER-SMT_2_NO: Normally open jumper This jumper has two pads in close proximity to each other. Apply solder to close the connection. Round pads are easier to solder for beginners, but are a lot larger. SparkFun Product that uses the round pads: SparkFun EL Sequencer <https://www.sparkfun.com/products/12781>
JP31 = pinhead:PINHD-1X2: PIN HEADER
JP40 = pinhead:PINHD-2X15: PIN HEADER
JP41 = pinhead:PINHD-2X8: PIN HEADER
LED1-LED5 = led:LED: LED OSRAM: - CHIPLED LG R971, LG N971, LY N971, LG Q971, LY Q971, LO R971, LY R971 LH N974, LH R974 LS Q976, LO Q976, LY Q976 LO Q996 - Hyper CHIPLED LW Q18S LB Q993, LB Q99A, LB R99A - SideLED LS A670, LO A670, LY A670, LG A670, LP A670 LB A673, LV A673, LT A673, LW A673 LH A674 LY A675 LS A676, LA A676, LO A676, LY A676, LW A676 LS A679, LY A679, LG A679 - Hyper Micro SIDELED® LS Y876, LA Y876, LO Y876, LY Y876 LT Y87S - SmartLED LW L88C, LW L88S LB L89C, LB L89S, LG L890 LS L89K, LO L89K, LY L89K LS L896, LA L896, LO L896, LY L896 - TOPLED LS T670, LO T670, LY T670, LG T670, LP T670 LSG T670, LSP T670, LSY T670, LOP T670, LYG T670 LG T671, LOG T671, LSG T671 LB T673, LV T673, LT T673, LW T673 LH T674 LS T676, LA T676, LO T676, LY T676, LB T676, LH T676, LSB T676, LW T676 LB T67C, LV T67C, LT T67C, LS T67K, LO T67K, LY T67K, LW E67C LS E67B, LA E67B, LO E67B, LY E67B, LB E67C, LV E67C, LT E67C LW T67C LS T679, LY T679, LG T679 LS T770, LO T770, LY T770, LG T770, LP T770 LB T773, LV T773, LT T773, LW T773 LH T774 LS E675, LA E675, LY E675, LS T675 LS T776, LA T776, LO T776, LY T776, LB T776 LHGB T686 LT T68C, LB T68C - Hyper Mini TOPLED® LB M676 - Mini TOPLED Santana® LG M470 LS M47K, LO M47K, LY M47K Source: http://www.osram.convergy.de LUXEON: - LUMILED® LXK2-PW12-R00, LXK2-PW12-S00, LXK2-PW14-U00, LXK2-PW14-V00 LXK2-PM12-R00, LXK2-PM12-S00, LXK2-PM14-U00 LXK2-PE12-Q00, LXK2-PE12-R00, LXK2-PE12-S00, LXK2-PE14-T00, LXK2-PE14-U00 LXK2-PB12-K00, LXK2-PB12-L00, LXK2-PB12-M00, LXK2-PB14-N00, LXK2-PB14-P00, LXK2-PB14-Q00 LXK2-PR12-L00, LXK2-PR12-M00, LXK2-PR14-Q00, LXK2-PR14-R00 LXK2-PD12-Q00, LXK2-PD12-R00, LXK2-PD12-S00 LXK2-PH12-R00, LXK2-PH12-S00 LXK2-PL12-P00, LXK2-PL12-Q00, LXK2-PL12-R00 Source: www.luxeon.com KINGBRIGHT: KA-3528ASYC Source: www.kingbright.com; MFR: LITE-ON; MFR_PN: LTST-C191KRKT
R1 = milliLearn-ice40:R0402_COMPACT; MFR: PANASONIC; MFR_PN: ERJ-2RKF7502X
R2 R6 = milliLearn-ice40:R0402_COMPACT; MFR: PANASONIC; MFR_PN: ERJ-2RKF2402X
R3 = milliLearn-ice40:R0402_COMPACT; MFR: PANASONIC; MFR_PN: ERJ-2RKF2002X
R4 = milliLearn-ice40:R0402_COMPACT; MFR: PANASONIC; MFR_PN: ERJ-2RKF1602X
R5 R8 R17 R33 = milliLearn-ice40:R0402_COMPACT; MFR: PANASONIC; MFR_PN: ERJ-2RKF1202X
R7 R10-R13 R18-R21 R26 R28 R29 R31 = milliLearn-ice40:R0402_COMPACT; MFR: PANASONIC; MFR_PN: ERJ-2RKF1002X
R9 = milliLearn-ice40:R0402_COMPACT; MFR: PANASONIC; MFR_PN: ERJ-2RKF2201X
R14 R15 R27 R37 R38 = milliLearn-ice40:R0402_COMPACT; MFR: PANASONIC; MFR_PN: ERJ-2RKF1001X
R16 R34 R35 = milliLearn-ice40:R0402_COMPACT; MFR: PANASONIC; MFR_PN: ERJ-2RKF4701X
R22-R24 R32 = rcl:R-US_: RESISTOR, American symbol; MFR: YAGEO; MFR_PN: RL0603FR-070R5L; SPICEPREFIX: R
R25 = milliLearn-ice40:R0402_COMPACT; MFR: YAGEO; MFR_PN: RC0402FR-07100RL
R30 = milliLearn-ice40:R0402_COMPACT; MFR: PANASONIC; MFR_PN: ERJ-2RKF3002X
SW1 SW2 = milliLearn-ice40:TE_FSMJSMA: Tactile Switch OFF-MOM, Surface Mount; MFR: TE; MFR_PN: FSM4JSMATR
TP0 TP1-TP18 = testpad:TP: Test pad
U1 U3 U4 U10 = milliLearn-ice40:AP7366-W5-7; MFR: Diodes Inc; MFR_PN: AP7366-W5-7
U2 U11 = milliLearn-ice40:DSC6111CI2A-012.0000; MFR: MICROCHIP; MFR_PN: DSC6111CI2A-012.0000
U5 = gtjennings_pcb_121217_1200_release:MICROBUILDER_FT232H; MFR: FTDI; MFR_PN: FT232HQ-REEL
U6 = milliLearn-ice40:MICROCHIP_93*76?: 8K Microwire Compatible Serial EEPROM Source: http://ww1.microchip.com/downloads/en/DeviceDoc/21796H.pdf; MF: MICROCHIP; MFR: MICROCHIP; MFR_PN: 93LC56BT-I/OT; MPN: 93LC76BT-I/OT; OC_FARNELL: 1556170; OC_NEWARK: 61H6848
U7 = milliLearn-ice40:MT25QL128ABA1EW7; MFR: MICRON; MFR_PN: MT25QL128ABA1EW7-0SIT
U8 = milliLearn-ice40:ICE40UP5K/3K-SG48; MFR: LATTICE; MFR_PN: ICE40UP5K-SG48I
U9 = milliLearn-ice40:INA4180A4IPWR; MFR: TI; MFR_PN: INA4180A4IPWR
U12 U13 = milliLearn-ice40:SPH0645LM4H-B; MFR: KNOWLES; MFR_PN: SPH0645LM4H-B
U14 U15 = milliLearn-ice40:CY15B104Q-LHXI; MANUFACTURER: Cypress; MFG_PN: CY15B104Q-LHXI; MFR: CYPRESS; MFR_PN: CY15B104Q-LHXI
U16 U17 = milliLearn-ice40:AT25QF641B-SHB-T; MFR: ADESTO; MFR_PN: AT25QF641B-SHB-T